# EAGLE design led-er-v3-module-d (EAGLE 7.5.0)
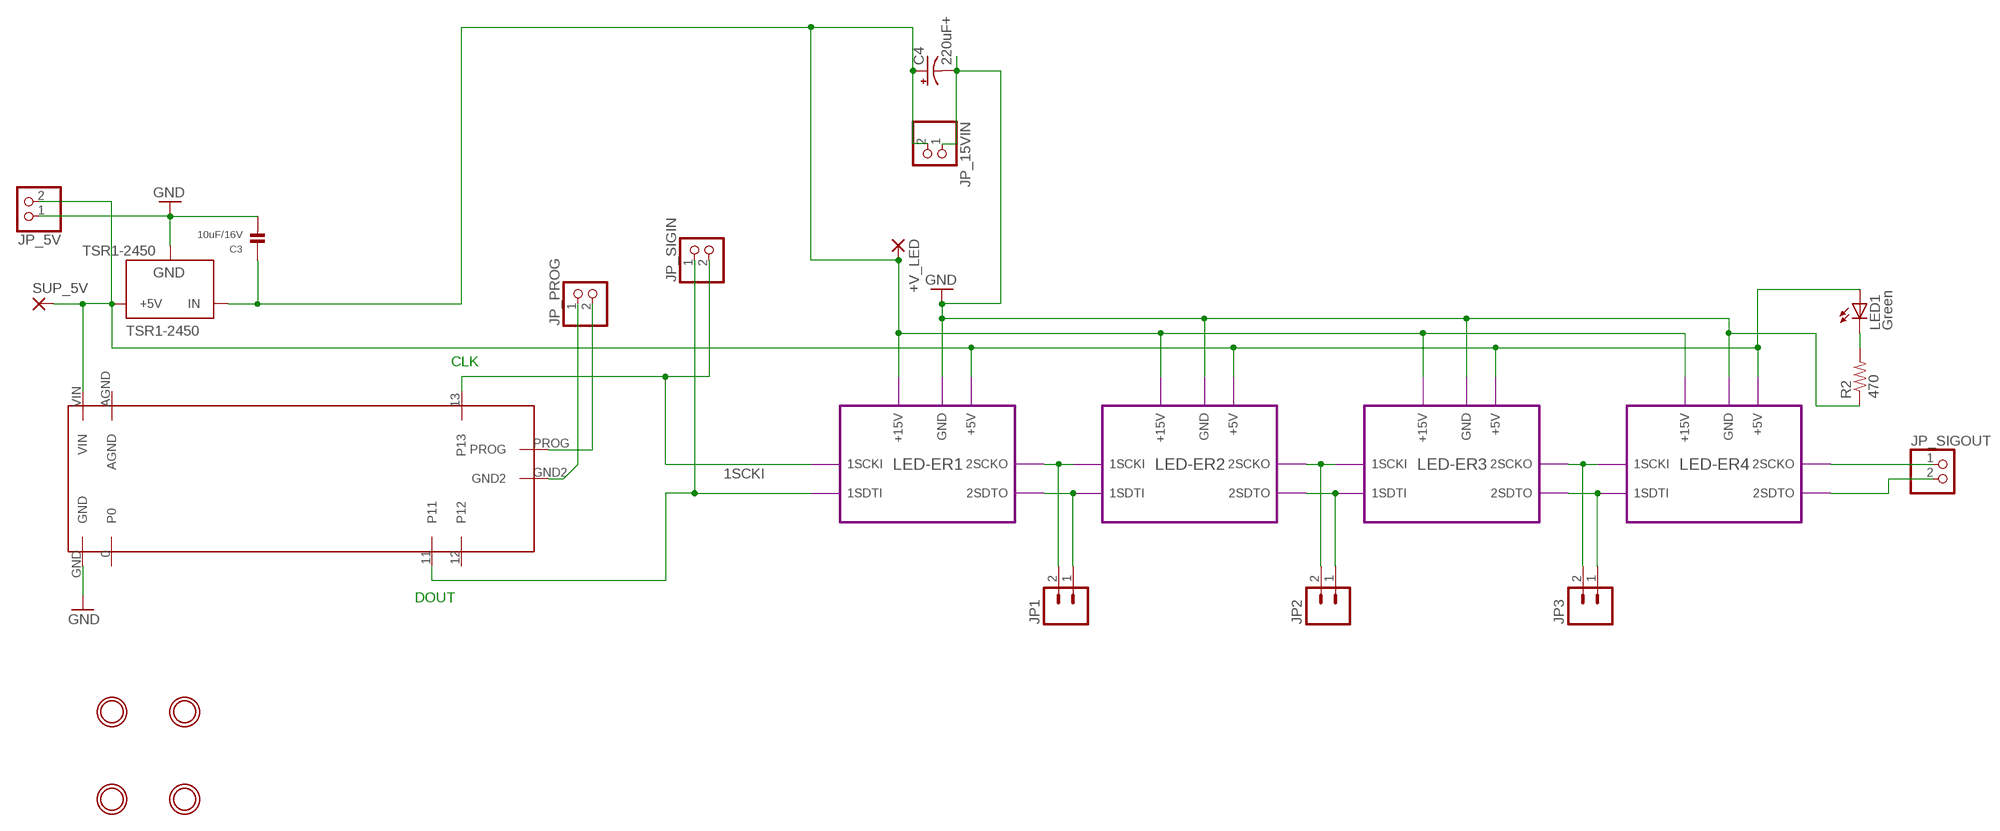
[diagram p0: schematic, sheet 1]

## Parts
+V_LED  3,17/1,1  [3,17/1,1]
C3  10uF/16V  CAP_CERAMIC0805  [0805]
C4  220uF+  CPOL-USE5-8.5  [E5-8,5]
JP1  HEADER_SMD_2_MALESMD-STRAIGHT-ALT-FEMALE  [1X06_SMD_STRAIGHT_ALT]
JP2  HEADER_SMD_2_MALESMD-STRAIGHT-ALT-FEMALE  [1X06_SMD_STRAIGHT_ALT]
JP3  HEADER_SMD_2_MALESMD-STRAIGHT-ALT-FEMALE  [1X06_SMD_STRAIGHT_ALT]
JP_5V  HEADER-1X2  [1X02_OVAL]
JP_15VIN  HEADER-1X2  [1X02_OVAL]
JP_PROG  HEADER-1X2  [1X02_OVAL]
JP_SIGIN  HEADER-1X2  [1X02_OVAL]
JP_SIGOUT  HEADER-1X2  [1X02_OVAL]
LED1  Green  LED5MM  [LED5MM]
R2  470  RESISTOR_DUAL  [0805-THM]
SUP_5V  3,17/1,1  [3,17/1,1]
TSR1-2450  TSR1-2450  [TSR-1]
U$1  MOUNTINGHOLE  [MOUNTINGHOLE_3.0_PLATED]
U$2  MOUNTINGHOLE  [MOUNTINGHOLE_3.0_PLATED]
U$3  MOUNTINGHOLE  [MOUNTINGHOLE_3.0_PLATED]
U$4  MOUNTINGHOLE  [MOUNTINGHOLE_3.0_PLATED]
U$5  TEENSY_LEDER  [TEENSY_LEDER]

## Module instances
LED-ER1 = LED-ER
LED-ER2 = LED-ER
LED-ER3 = LED-ER
LED-ER4 = LED-ER

## Nets
1SCKI: JP_SIGIN.2 U$5.13 ; port LED-ER1.1SCKI
1SDTI: JP_SIGIN.1 U$5.11 ; port LED-ER1.1SDTI
+5V: JP_5V.2 LED1.A SUP_5V.1(P) TSR1-2450.3(+5V) U$5.VIN ; port LED-ER1.+5V LED-ER2.+5V LED-ER3.+5V LED-ER4.+5V
GND: C3.2 C4.- JP_5V.1 JP_15VIN.1 R2.1 TSR1-2450.2(GND) U$5.GND ; port LED-ER1.GND LED-ER2.GND LED-ER3.GND LED-ER4.GND
N$1: LED1.K(C) R2.2
N$2: JP1.2 ; port LED-ER1.2SCKO LED-ER2.1SCKI
N$3: JP1.1 ; port LED-ER1.2SDTO LED-ER2.1SDTI
N$4: JP2.2 ; port LED-ER2.2SCKO LED-ER3.1SCKI
N$5: JP2.1 ; port LED-ER2.2SDTO LED-ER3.1SDTI
N$6: JP3.2 ; port LED-ER3.2SCKO LED-ER4.1SCKI
N$7: JP3.1 ; port LED-ER3.2SDTO LED-ER4.1SDTI
N$8: JP_SIGOUT.1 ; port LED-ER4.2SCKO
N$9: JP_SIGOUT.2 ; port LED-ER4.2SDTO
N$54: JP_PROG.1 U$5.GND2
N$55: JP_PROG.2 U$5.PROG
VIN: +V_LED.1(P) C3.1 C4.+ JP_15VIN.2 TSR1-2450.1(IN) ; port LED-ER1.+15V LED-ER2.+15V LED-ER3.+15V LED-ER4.+15V
Unconnected: U$5.0 U$5.12 U$5.AGND

## Notes on the sheet
- CLK
- DOUT

## Library data of the parts
+V_LED SUP_5V = wirepad:3,17/1,1: THROUGH-HOLE PAD
C3 = microbuilder:CAP_CERAMIC: Ceramic Capacitors 0402 - 0402 Surface Mount Capacitors 16pF 50V 5% [Digikey: 445-4899-2-ND] 18pF 50V 5% [Digikey: 490-1281-2-ND] 22pF 50V 5% [Digikey: 490-1283-2-ND] 68pF 50V 5% [Digikey: 490-1289-2-ND] 0.1uF 10V 10% [Digikey: 490-1318-2-ND] 1.0uF 6.3V 10% [Digikey: 490-1320-2-ND] 0603 - 0603 Surface Mount Capacitors 16 pF 50V 5% [Digikey: 445-5051-2-ND] 22 pF 50V [Digikey: PCC220ACVTR-ND] 33 pF 50V 5% [Digikey: 490-1415-1-ND] 56pF 50V 5% [Digikey: 490-1421-1-ND] 220pF 50V 5% [Digikey: 445-1285-1-ND] 680 pF 50V 2200 pF 50V 5% C0G [Digikey: 445-1297-1-ND] 5600 pF 100V 5% X7R [Digikey: 478-3711-1-ND] 0.1 µF 25V 10% [Digikey: PCC2277TR-ND] 0.22 µF 16V 10% X7R [Digikey: 445-1318-1-ND] 1.0 µF 25V 10% [Digikey: 445-5146-2-ND] 0603 - RF Specific 3pF 250V +/-0.1pF RF [Digikey: 712-1347-1-ND] 18 pF 250V 5% [Digikey: 478-3505-1-ND or 712-1322-1-ND] 56 pF 250V 5% C0G RF [Digikey: 490-4867-1-ND] 68 pF 250V RF [Digikey: 490-4868-1-ND] 0805 - 0805 Surface Mount Capacitors 220 pF 250V 2% RF Ceramic Capacitor [Digikey: 712-1398-1-ND] 1000 pF 50V 2% NP0 Ceramic Capacitor [Digikey: 478-3760-1-ND] 0.1 µF 25V 10% Ceramic Capacitor [Digikey: PCC1828TR-ND] 1.0 µF 16V 10% Ceramic Capacitor[Digikey: 490-1691-2-ND] 10.0 µF 10V 10% Ceramic Capacitor[Digikey: 709-1228-1-ND] 10.0 uF 16V 10% Ceramic Capacitor [Digikey: 478-5165-2-ND] 47 uF 6.3V 20% Ceramic Capacitor [Digikey: 587-1779-1-ND or 399-5506-1-ND] 1206 - 1206 Surface Mount Capacitors 47uF 10V 20% Ceramic Capacitor [Digikey: 490-5528-1-ND or 399-5508-1-ND or 445-6010-1-ND] 100uF 6.3V -20%, +80% Y5V Ceramic Capacitor (Digikey: 490-4512-1-ND, Mouser: 81-GRM31CF50J107ZE1L)
C4 = adafruit:CPOL-US: POLARIZED CAPACITOR, American symbol
JP1-JP3 = Andrews:HEADER_SMD_2_MALE: Header 6 Standard 6-pin 0.1" header. Use with straight break away headers (SKU : PRT-00116), right angle break away headers (PRT-00553), swiss pins (PRT-00743), machine pins (PRT-00117), and female headers (PRT-00115). Molex polarized connector foot print use with SKU : PRT-08094 with associated crimp pins and housings. NOTES ON THE VARIANTS LOCK and LOCK_LONGPADS... This footprint was designed to help hold the alignment of a through-hole component (i.e. 6-pin header) while soldering it into place. You may notice that each hole has been shifted either up or down by 0.005 of an inch from it's more standard position (which is a perfectly straight line). This slight alteration caused the pins (the squares in the middle) to touch the edges of the holes. Because they are alternating, it causes a "brace" to hold the component in place. 0.005 has proven to be the perfect amount of "off-center" position when using our standard breakaway headers. Although looks a little odd when you look at the bare footprint, once you have a header in there, the alteration is very hard to notice. Also,if you push a header all the way into place, it is covered up entirely on the bottom side. This idea of altering the position of holes to aid alignment will be further integrated into the Sparkfun Library for other footprints. It can help hold any component with 3 or more connection pins.; PROD_ID: CONN-10203
JP_5V JP_15VIN JP_PROG JP_SIGIN JP_SIGOUT = microbuilder:HEADER-1X2: PIN HEADER
LED1 = adafruit:LED: LED OSRAM: - CHIPLED LG R971, LG N971, LY N971, LG Q971, LY Q971, LO R971, LY R971 LH N974, LH R974 LS Q976, LO Q976, LY Q976 LO Q996 - Hyper CHIPLED LW Q18S LB Q993, LB Q99A, LB R99A - SideLED LS A670, LO A670, LY A670, LG A670, LP A670 LB A673, LV A673, LT A673, LW A673 LH A674 LY A675 LS A676, LA A676, LO A676, LY A676, LW A676 LS A679, LY A679, LG A679 - Hyper Micro SIDELED® LS Y876, LA Y876, LO Y876, LY Y876 LT Y87S - SmartLED LW L88C, LW L88S LB L89C, LB L89S, LG L890 LS L89K, LO L89K, LY L89K LS L896, LA L896, LO L896, LY L896 - TOPLED LS T670, LO T670, LY T670, LG T670, LP T670 LSG T670, LSP T670, LSY T670, LOP T670, LYG T670 LG T671, LOG T671, LSG T671 LB T673, LV T673, LT T673, LW T673 LH T674 LS T676, LA T676, LO T676, LY T676, LB T676, LH T676, LSB T676, LW T676 LB T67C, LV T67C, LT T67C, LS T67K, LO T67K, LY T67K, LW E67C LS E67B, LA E67B, LO E67B, LY E67B, LB E67C, LV E67C, LT E67C LW T67C LS T679, LY T679, LG T679 LS T770, LO T770, LY T770, LG T770, LP T770 LB T773, LV T773, LT T773, LW T773 LH T774 LS E675, LA E675, LY E675, LS T675 LS T776, LA T776, LO T776, LY T776, LB T776 LHGB T686 LT T68C, LB T68C - Hyper Mini TOPLED® LB M676 - Mini TOPLED Santana® LG M470 LS M47K, LO M47K, LY M47K Source: http://www.osram.convergy.de/
R2 = microbuilder:RESISTOR_DUAL: Flip Flop resistor An 0805 resistor inside a standard 1/4W 5% resistor. Makes for easy mods Footprint taken from the Adafruit Industries Eagle Library.
TSR1-2450 = SteelCaveRobotics-Power:TSR1-2450: Traco Power TSR 1-2450 5.0v switching regulator
U$1-U$4 = microbuilder:MOUNTINGHOLE: Mounting Hole For #2 screws (0.086"/2.18mm width, 0.094"/2.4mm hole) use 2.5mm
U$5 = Andrews:TEENSY_LEDER

## Module LED-ER
Ports: 1SCKI(io) 1SDTI(io) 2SCKO(io) 2SDTO(io) +15V(io) GND(io) +5V(io)
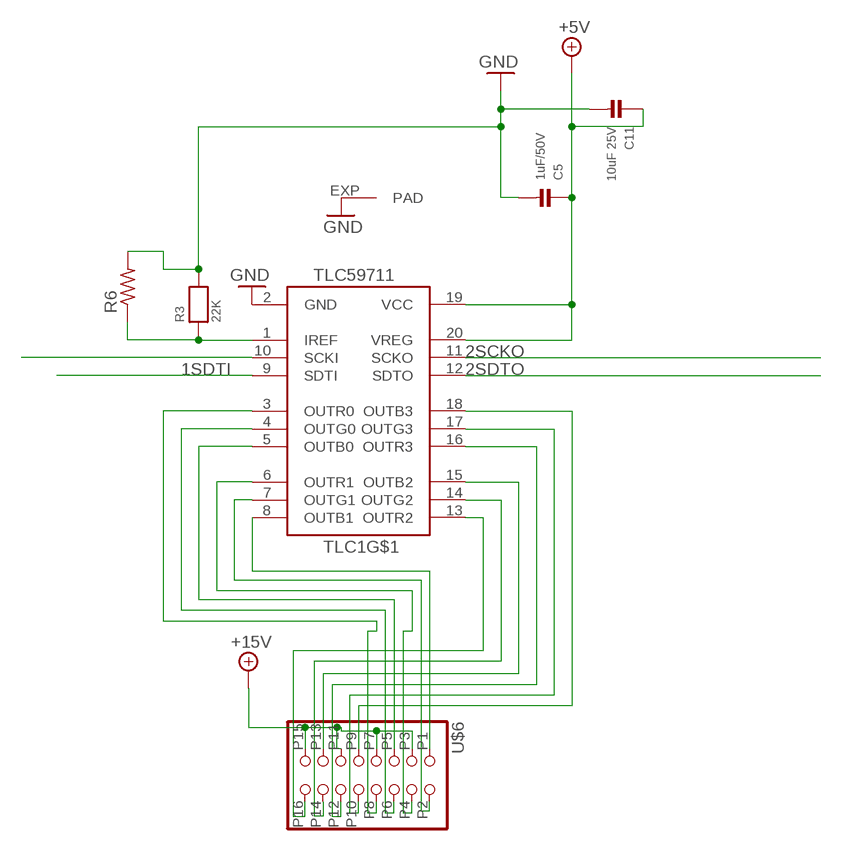
[diagram p1: schematic, module LED-ER, sheet 1]

### Parts
C5  1uF/50V  CAP_CERAMIC0805  [0805]
C11  10uF 25V  CAP_CERAMIC0805  [0805]
R3  22K  RESISTOR0805  [0805]
R6  R-US_0207/9  [0207/9]
TLC1  TLC59711  [HTSSOP20DAP]
U$6  HEADER-2X8-RIBBON  [2X08_RIBBON]

### Nets
1SCKI: TLC1.10(SCKI)
1SDTI: TLC1.9(SDTI)
2SCKO: TLC1.11(SCKO)
2SDTO: TLC1.12(SDTO)
+5V: C5.1 C11.1 TLC1.19(VCC) TLC1.20(VREG)
+15V: U$6.P3(P4) U$6.P7(P8) U$6.P11(P12) U$6.P15(P16)
B0: TLC1.5(OUTB0) U$6.P5(P6)
B1: TLC1.8(OUTB1) U$6.P1
B2: TLC1.15(OUTB2) U$6.P13(P14)
B3: TLC1.18(OUTB3) U$6.P9(P10)
G0: TLC1.4(OUTG0) U$6.P6(P5)
G1: TLC1.7(OUTG1) U$6.P2
G2: TLC1.14(OUTG2) U$6.P14(P13)
G3: TLC1.17(OUTG3) U$6.P10(P9)
GND: C5.2 C11.2 R3.2 R6.2 TLC1.2(GND) TLC1.EXP(PAD)
IREF: R3.1 R6.1 TLC1.1(IREF)
R0: TLC1.3(OUTR0) U$6.P8(P7)
R1: TLC1.6(OUTR1) U$6.P4(P3)
R2: TLC1.13(OUTR2) U$6.P16(P15)
R3: TLC1.16(OUTR3) U$6.P12(P11)

### Library data of the parts
C5 C11 = microbuilder:CAP_CERAMIC: Ceramic Capacitors 0402 - 0402 Surface Mount Capacitors 16pF 50V 5% [Digikey: 445-4899-2-ND] 18pF 50V 5% [Digikey: 490-1281-2-ND] 22pF 50V 5% [Digikey: 490-1283-2-ND] 68pF 50V 5% [Digikey: 490-1289-2-ND] 0.1uF 10V 10% [Digikey: 490-1318-2-ND] 1.0uF 6.3V 10% [Digikey: 490-1320-2-ND] 0603 - 0603 Surface Mount Capacitors 16 pF 50V 5% [Digikey: 445-5051-2-ND] 22 pF 50V [Digikey: PCC220ACVTR-ND] 33 pF 50V 5% [Digikey: 490-1415-1-ND] 56pF 50V 5% [Digikey: 490-1421-1-ND] 220pF 50V 5% [Digikey: 445-1285-1-ND] 680 pF 50V 2200 pF 50V 5% C0G [Digikey: 445-1297-1-ND] 5600 pF 100V 5% X7R [Digikey: 478-3711-1-ND] 0.1 µF 25V 10% [Digikey: PCC2277TR-ND] 0.22 µF 16V 10% X7R [Digikey: 445-1318-1-ND] 1.0 µF 25V 10% [Digikey: 445-5146-2-ND] 0603 - RF Specific 3pF 250V +/-0.1pF RF [Digikey: 712-1347-1-ND] 18 pF 250V 5% [Digikey: 478-3505-1-ND or 712-1322-1-ND] 56 pF 250V 5% C0G RF [Digikey: 490-4867-1-ND] 68 pF 250V RF [Digikey: 490-4868-1-ND] 0805 - 0805 Surface Mount Capacitors 220 pF 250V 2% RF Ceramic Capacitor [Digikey: 712-1398-1-ND] 1000 pF 50V 2% NP0 Ceramic Capacitor [Digikey: 478-3760-1-ND] 0.1 µF 25V 10% Ceramic Capacitor [Digikey: PCC1828TR-ND] 1.0 µF 16V 10% Ceramic Capacitor[Digikey: 490-1691-2-ND] 10.0 µF 10V 10% Ceramic Capacitor[Digikey: 709-1228-1-ND] 10.0 uF 16V 10% Ceramic Capacitor [Digikey: 478-5165-2-ND] 47 uF 6.3V 20% Ceramic Capacitor [Digikey: 587-1779-1-ND or 399-5506-1-ND] 1206 - 1206 Surface Mount Capacitors 47uF 10V 20% Ceramic Capacitor [Digikey: 490-5528-1-ND or 399-5508-1-ND or 445-6010-1-ND] 100uF 6.3V -20%, +80% Y5V Ceramic Capacitor (Digikey: 490-4512-1-ND, Mouser: 81-GRM31CF50J107ZE1L)
R3 = microbuilder:RESISTOR: Resistors 0402 - 0402 Surface Mount Package 22 Ohm 1% 1/16W [Digikey: 311-22.0LRTR-ND] 33 Ohm 5% 1/16W 1.0K 5% 1/16W 1.5K 5% 1/16W 2.0K 1% 1/16W 10.0K 1% 1/16W [Digikey: 311-10.0KLRTR-ND] 10.0K 5% 1/16W [Digikey: RMCF0402JT10K0TR-ND] 12.1K 1% 1/16W [Digikey: 311-22.0LRTR-ND] 100.0K 5% 1/16W 0603 - 0603 Surface Mount Package 0 Ohm 1/10 Watt 1% Resistor 15 Ohm 1/10 Watt 1% Resistor 33 Ohm 1/10 Watt 1% Resistor 49.9 Ohm 1/10 Watt 1% Resistor 100 Ohm 1/10 Watt 1% Resistor 150 Ohm 1/10 Watt 1% Resistor 240 Ohm 1/10 Watt 1% Resistor 390 Ohm 1/10 Watt 1% Resistor 560 Ohm 1/10 Watt 1% Resistor 680 Ohm 1/10 Watt 1% Resistor 750 Ohm 1/10 Watt 1% Resistor 1.0K Ohm 1/10 Watt 1% Resistor 1.5K Ohm 1/10 Watt 1% Resistor 2.0K Ohm 1/10 Watt 1% Resistor 2.2K Ohm 1/10 Watt 1% Resistor 3.3K Ohm 1/10 Watt 1% Resistor 4.7K Ohm 1/10 Watt 1% Resistor 10.0K Ohm 1/10 Watt 1% Resistor 12.0K Ohm 1/10 Watt 1% Resistor 12.1K Ohm 1/10 Watt 1% Resistor 20.0K Ohm 1/10 Watt 1% Resistor 33.0K Ohm 1/10 Watt 1% Resistor 100.0K Ohm 1/10 Watt 1% Resistor 0805 - 0805 Surface Mount Package 0 Ohm 1/8 Watt 1% Resistor 33 Ohm 1/8 Watt 1% Resistor 100 Ohm 1/8 Watt 1% Resistor 150 Ohm 1/8 Watt 1% Resistor 200 Ohm 1/8 Watt 1% Resistor 240 Ohm 1/8 Watt 1% Resistor 330 Ohm 1/8 Watt 1% Resistor 390 Ohm 1/8 Watt 1% Resistor 470 Ohm 1/8 Watt 1% Resistor 1.0K Ohm 1/8 Watt 1% Resistor 1.5K Ohm 1/8 Watt 1% Resistor 2.0K Ohm 1/8 Watt 1% Resistor 4.7K Ohm 1/8 Watt 1% Resistor 5.1K Ohm 1/8 Watt 1% Resistor 5.6K Ohm 1/8 Watt 1% Resistor 10.0K Ohm 1/8 Watt 1% Resistor 22.0K Ohm 1/8 Watt 1% Resistor 33.0K Ohm 1/8 Watt 1% Resistor 100K Ohm 1/8 Watt 1% Resistor 1206 - 1206 Surface Mount Package 2012 - 2010 Surface Mount Package 0.11 Ohm 1/2 Watt 1% Resistor - Digikey: RHM.11UCT-ND
R6 = adafruit:R-US_: RESISTOR, American symbol
TLC1 = adafruit:TLC59711
U$6 = Andrews:HEADER-2X8-RIBBON

## Board
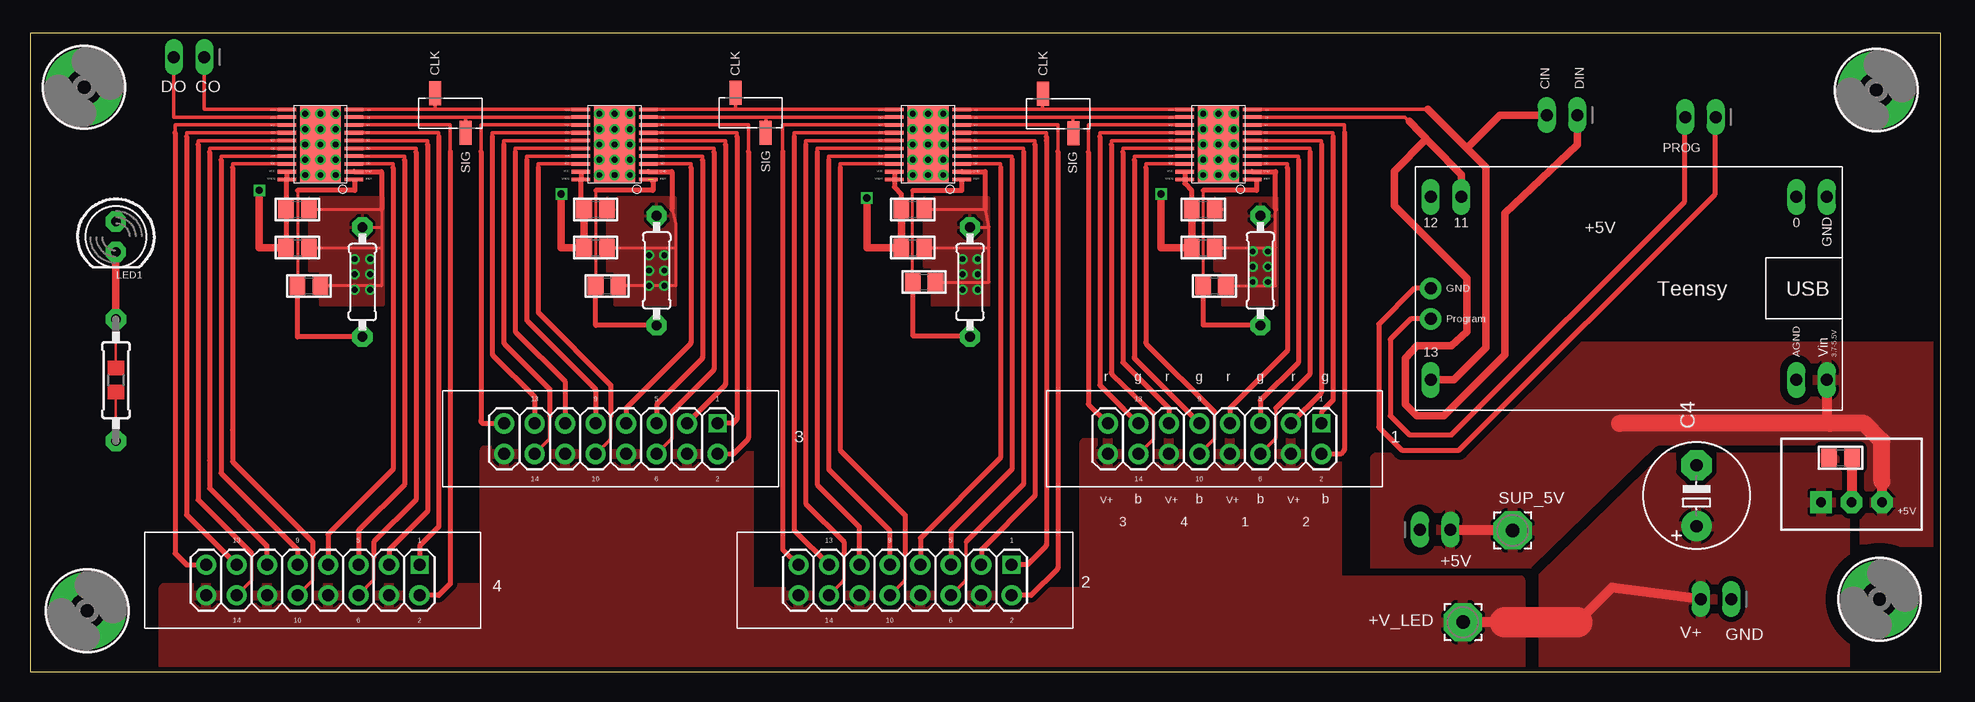
[diagram p2: board, top side]
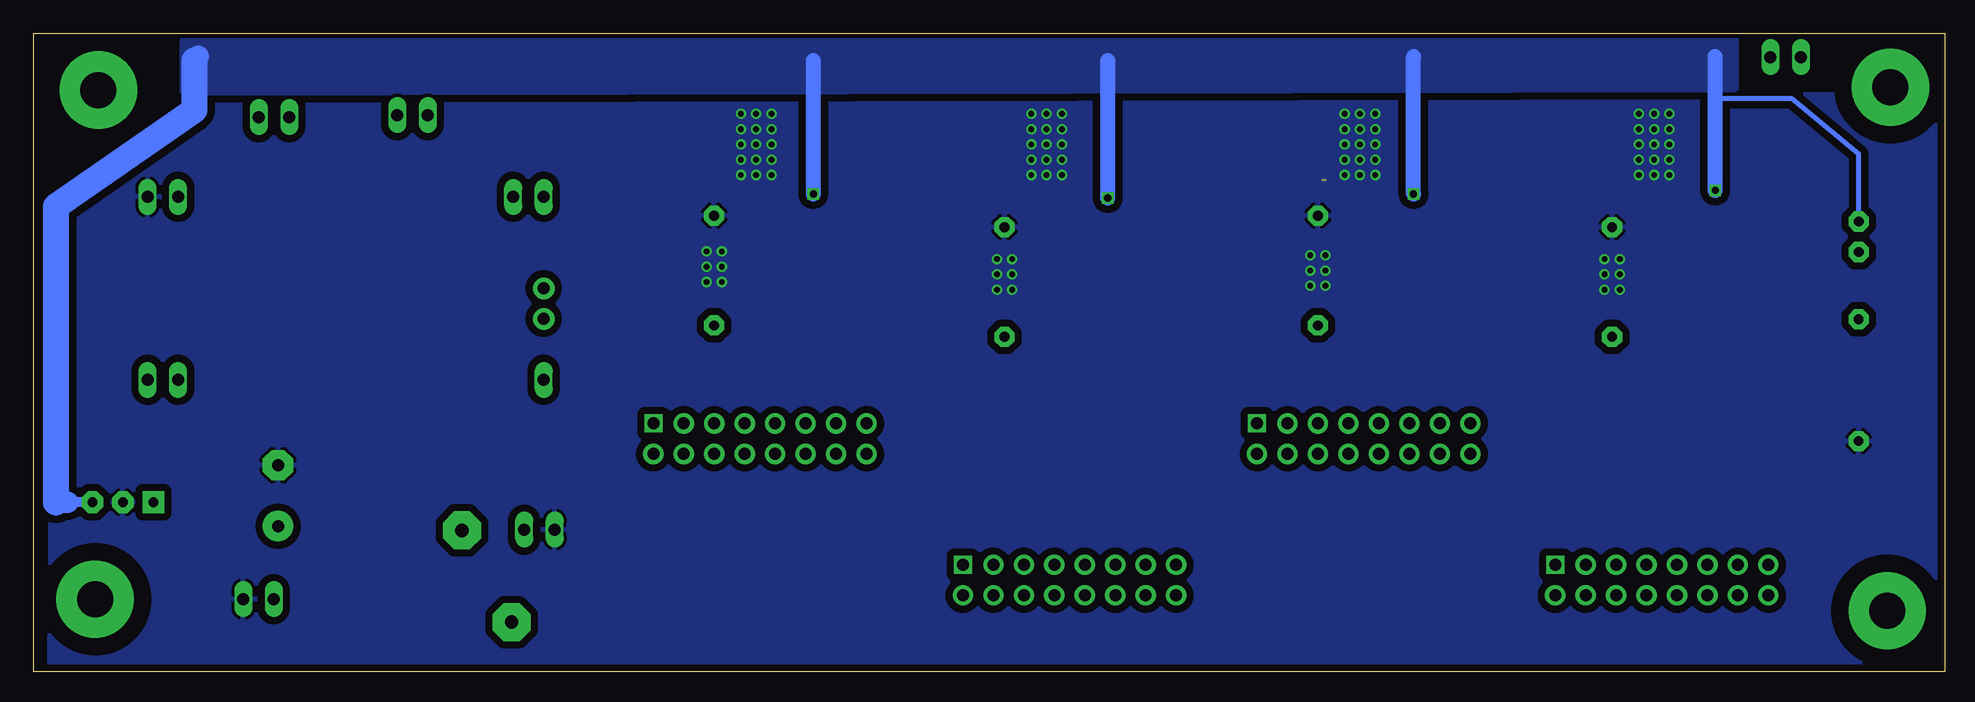
[diagram p3: board, bottom side, seen from below]

Size 159.28 x 53.23 mm. Coordinates in mm from the lower left corner, seen from the top.
Outline: 159.28,0 159.28,53.23 0,53.23 0,0 159.26,0
Copper layers (1*16): Top 0.0356mm / dielectric 1.5011mm / Bottom 0.0356mm
Design rules "LaenPCBOrder": minimum track width 6mil, minimum drill 13mil, track to track 6mil, track to pad 6mil, pad to pad 6mil, via to via 6mil, smd to smd 6mil, copper to edge 15mil, drill to drill 6mil, minimum pad ring 7mil, minimum via ring 7mil, stop-mask expansion 3mil, vias tented up to drill 0mil, thermal gap 10mil

### Footprints (pad centres in the part's own frame; a part is rotated, then mirrored left to right if it is on the bottom)
3,17/1,1 = drill 1.118 pad 3.175 octagon: 1 0,0
0805 = smd 1.3 x 1.5: 1 -0.95,0; 2 0.95,0
E5-8,5 = drill 1.016 pad 2.54: + -2.54,0 | drill 1.016 pad 2.54 octagon: - 2.54,0
1X06_SMD_STRAIGHT_ALT = smd 1 x 2: 1 0,-1.65; 2 -2.54,1.65
1X02_OVAL = drill 1 long: 1 -1.27,0; 2 1.27,0
LED5MM = drill 0.813 pad 1.676 octagon: A -1.27,0; K 1.27,0
0207/9 = drill 0.813 pad 1.676 octagon: 1 -4.572,0; 2 4.572,0
HTSSOP20DAP = smd 0.3 x 1.55: 1 -2.925,-2.8; 2 -2.275,-2.8; 3 -1.625,-2.8; 4 -0.975,-2.8; 5 -0.325,-2.8; 6 0.325,-2.8; 7 0.975,-2.8; 8 1.625,-2.8; 9 2.275,-2.8; 10 2.925,-2.8; 11 2.925,2.8; 12 2.275,2.8; 13 1.625,2.8; 14 0.975,2.8; 15 0.325,2.8; 16 -0.325,2.8; 17 -0.975,2.8; 18 -1.625,2.8; 19 -2.275,2.8; 20 -2.925,2.8 | smd 6.5 x 3.4: EXP 0,0
2X08_RIBBON = drill 1 pad 1.676: P1 -8.89,1.27; P3 -6.35,1.27; P4 -6.35,-1.27; P5 -3.81,1.27; P6 -3.81,-1.27; P7 -1.27,1.27; P8 -1.27,-1.27; P9 1.27,1.27; P10 1.27,-1.27; P11 3.81,1.27; P12 3.81,-1.27; P13 6.35,1.27; P14 6.35,-1.27; P15 8.89,1.27; P16 8.89,-1.27 | drill 1 square: P2 -8.89,-1.27
0805-THM = drill 0.813 pad 1.676 octagon: 1 -5.08,0; 2 5.08,0
TSR-1 = drill 0.8 pad 1.8 square: 1 -2.54,-1.5 | drill 0.8 pad 1.8 octagon: 2 0,-1.5; 3 2.54,-1.5
MOUNTINGHOLE_3.0_PLATED = drill 3 pad 6.452: P$1 0,0
TEENSY_LEDER = drill 1 pad 1.422 long: 0 12.7,7.62; 11 -15.24,7.62; 12 -17.78,7.62; 13 -17.78,-7.62; AGND 12.7,-7.62; GND 15.24,7.62; VIN 15.24,-7.62 | drill 1 pad 1.778: GND2 -17.78,0; PROG -17.78,-2.54

### Placement (x,y rotation side)
+V_LED  119.44,4.14 0 top
C3  150.92,17.84 0 top
C4  138.91,14.68 90 top
JP1  86.97,46.52 0 top
JP2  61.33,46.6 0 top
JP3  36.32,46.56 0 top
JP_5V  117.13,11.85 0 top
JP_15VIN  140.53,6.06 180 top
JP_PROG  139.24,46.23 180 top
JP_SIGIN  127.7,46.4 180 top
JP_SIGOUT  13.25,51.24 180 top
LED1  7.16,36.26 270 top
LED-ER1:C5  1uF/50V  [0805]  97.78,38.54 0 top
LED-ER1:C11  10uF 25V  [0805]  97.78,35.36 0 top
LED-ER1:R3  22K  [0805]  98.74,32.17 0 top
LED-ER1:R6  [0207/9]  102.56,33.44 90 top
LED-ER1:TLC1  TLC59711  [HTSSOP20DAP]  99.06,43.96 90 top
LED-ER1:U$6  HEADER-2X8-RIBBON  [2X08_RIBBON]  98.74,19.43 180 top
LED-ER2:C5  1uF/50V  [0805]  73.58,38.54 0 top
LED-ER2:C11  10uF 25V  [0805]  73.58,35.36 0 top
LED-ER2:R3  22K  [0805]  74.53,32.49 0 top
LED-ER2:R6  [0207/9]  78.35,32.49 90 top
LED-ER2:TLC1  TLC59711  [HTSSOP20DAP]  74.85,43.96 90 top
LED-ER2:U$6  HEADER-2X8-RIBBON  [2X08_RIBBON]  72.94,7.64 180 top
LED-ER3:C5  1uF/50V  [0805]  47.14,35.36 0 top
LED-ER3:C11  10uF 25V  [0805]  47.14,38.54 0 top
LED-ER3:R3  22K  [0805]  48.1,32.17 0 top
LED-ER3:R6  [0207/9]  52.24,33.44 90 top
LED-ER3:TLC1  TLC59711  [HTSSOP20DAP]  48.73,43.96 90 top
LED-ER3:U$6  HEADER-2X8-RIBBON  [2X08_RIBBON]  48.41,19.43 180 top
LED-ER4:C5  1uF/50V  [0805]  22.3,35.36 0 top
LED-ER4:C11  10uF 25V  [0805]  22.3,38.54 0 top
LED-ER4:R3  22K  [0805]  23.25,32.17 0 top
LED-ER4:R6  [0207/9]  27.71,32.49 90 top
LED-ER4:TLC1  TLC59711  [HTSSOP20DAP]  24.21,43.96 90 top
LED-ER4:U$6  HEADER-2X8-RIBBON  [2X08_RIBBON]  23.57,7.64 180 top
R2  7.16,24.31 90 top
SUP_5V  123.58,11.79 0 top
TSR1-2450  151.84,15.63 0 top
U$1  153.89,48.48 0 top
U$2  4.78,5.1 0 top
U$3  4.51,48.72 0 top
U$4  154.16,6.05 0 top
U$5  134.54,31.95 0 top

### Tracks (layer width: path | path; a pad name or v marks a point on that pad's centre or on a via)
1SCKI
  Top 0.305: LED-ER1:TLC1.10 116.52,46.88 | U$5.13
  Top 0.61: 116.52,46.88 119.76,43.64 | 119.76,43.64 121.36,42.04 121.36,27.01 118.68,24.33 U$5.13 | JP_SIGIN.2 122.53,46.4 119.76,43.64
1SDTI
  Top 0.305: LED-ER1:TLC1.9 114.62,46.23 114.98,45.87 | 119.31,39.58 U$5.11
  Top 0.61: 116.85,43.91 116.37,44.38 113.71,41.73 113.71,38.86 119.76,32.81 119.76,28.35 118.49,27.17 115.62,27.17 114.67,26.12 114.67,22.3 115.62,21.34 117.85,21.34 122.95,26.44 122.95,38.22 128.97,43.93 JP_SIGIN.1 | 116.85,43.91 119.31,41.45 119.31,39.58 | 114.98,45.87 116.85,43.91
+5V  (via drill 0.6)
  Top 0.254: LED-ER1:TLC1.20 | LED-ER3:TLC1.20 46.19,41.03 | LED-ER4:TLC1.20 21.35,41.03 | LED-ER2:C5.1 | LED-ER3:C11.1
  Top 0.305: LED-ER1:C5.1 | LED-ER2:C5.1 | LED-ER4:TLC1.19 21.41,41.55 | LED-ER3:TLC1.19 45.93,41.57 | LED-ER2:TLC1.19 | LED-ER2:TLC1.19 72.05,41.58 | LED-ER1:TLC1.19 | LED-ER1:TLC1.19 96.26,41.59
  Top 0.406: LED-ER4:C5.1 LED-ER4:C11.1 21.41,38.54 LED-ER4:TLC1.20 21.41,41.55 | LED-ER1:C5.1 96.83,40.13 96.26,40.7 LED-ER1:TLC1.20 96.26,41.59 | LED-ER2:C5.1 72.62,39.81 72.05,40.38 LED-ER2:TLC1.20 72.05,41.58 | LED-ER3:C11.1 45.93,38.54 LED-ER3:TLC1.20 45.93,41.57 | 72.05,41.58 | 96.26,41.59 | LED-ER1:C11.1 | LED-ER2:C11.1
  Top 0.61: v94.28,39.81 94.28,35.35 LED-ER1:C11.1 LED-ER1:C5.1 | v69.75,39.5 69.75,35.35 LED-ER2:C11.1 LED-ER2:C5.1 | LED-ER3:C11.1 LED-ER3:C5.1 44.27,35.35 v44.27,39.81 | LED-ER4:C5.1 19.11,35.35 v19.11,40.13
  Top 0.813: TSR1-2450.3 154.38,15.85 154.36,15.88 | U$5.VIN 149.78,20.95 150.02,20.7 | SUP_5V.1 118.46,11.79 JP_5V.2
  Top 1.422: 154.36,15.88 154.36,19.23 152.89,20.7 150.02,20.7 132.5,20.7
  Bottom 0.406: LED1.A 7.16,43.15 12.74,47.78 19.11,47.78
  Bottom 0.813: TSR1-2450.3 156.05,14.13 156.46,14.14
  Bottom 1.27: v94.28,39.81 94.28,50.96 | v69.75,39.5 69.75,50.96 | v44.27,39.81 44.27,51.28 | v19.11,40.13 19.11,47.78 19.11,51.28
  Bottom 1.778: 156.46,14.14 157.41,14.11 | 145.88,50.96 145.56,51.28
  Bottom 2.184: 157.41,14.11 157.41,38.8 145.88,46.82 145.88,50.96
  pour Bottom (isolate 0.305): 17.52,48.73 17.52,52.87 146.72,52.56 146.72,48.41
  pour Top (isolate 0.61, rank 3): 112.12,17.84 112.12,8.6 124.86,8.6 136.01,19.11 152.89,19.11 152.89,10.83 158.94,10.83 158.94,27.07 129,27.07 119.76,17.84
GND  (via drill 0.48)  (3 unrouted)
  Top 0.254: LED-ER1:TLC1.2 | LED-ER1:R3.2 103.83,32.17 103.83,35.35 | 103.83,35.35 103.83,38.54 | LED-ER2:C5.2 | LED-ER2:R3.2 79.95,32.49 79.95,35.35 | 79.95,35.35 79.95,37.06 | 79.95,37.06 79.63,38.54 LED-ER2:C5.2 | LED-ER2:R6.2 79.95,37.06 | 53.51,38.54 53.83,37.38 53.83,35.35 | 53.83,35.35 53.83,32.17 v52.87,32.17 v51.6,32.17 LED-ER3:R3.2 | LED-ER3:R3.2 | 29.3,37.06 29.3,38.54 LED-ER4:C11.2 | 29.3,37.06 29.3,35.35 | 29.3,35.35 29.3,32.17 LED-ER4:R3.2 | LED-ER4:R6.2 29.3,37.06 | LED-ER4:C5.2 29.3,35.35 | LED-ER3:C5.2 53.83,35.35 | LED-ER2:C11.2 79.95,35.35 | LED-ER1:C11.2 103.83,35.35
  Top 0.305: 29.3,41.68 29.3,41.63 | 53.51,41.68 53.51,41.62 | 103.83,41.68 103.83,41.62
  Top 0.406: 103.83,38.54 103.83,41.62 | 79.63,38.54 79.63,41.68 LED-ER2:TLC1.2 | 53.51,41.62 53.51,38.54 | 29.3,41.63 29.3,38.54 | LED-ER4:TLC1.2 29.3,41.68 | LED-ER3:TLC1.2 53.51,41.68 | LED-ER1:TLC1.2 103.83,41.68
  Top 0.813: C3.2 151.87,14.13 TSR1-2450.2
  other vias: 22.93,46.5 24.21,46.5 25.48,46.5 22.93,45.23 24.21,45.23 22.93,43.96 24.21,43.96 25.48,43.96 22.93,42.68 24.21,42.68 25.48,42.68 22.93,41.41 24.21,41.41 25.48,41.41 25.48,45.23 97.78,46.5 99.06,46.5 100.33,46.5 97.78,45.23 99.06,45.23 100.33,45.23 97.78,43.96 99.06,43.96 100.33,43.96 97.78,42.68 99.06,42.68 100.33,42.68 97.78,41.41 99.06,41.41 100.33,41.41 73.58,46.5 74.85,46.5 76.13,46.5 73.58,45.23 74.85,45.23 76.13,45.23 73.58,43.96 74.85,43.96 76.13,43.96 73.58,42.68 74.85,42.68 76.13,42.68 73.58,41.41 74.85,41.41 76.13,41.41 47.46,46.5 48.73,46.5 50.01,46.5 47.46,45.23 48.73,45.23 47.46,43.96 48.73,43.96 50.01,43.96 47.46,42.68 48.73,42.68 50.01,42.68 47.46,41.41 48.73,41.41 50.01,41.41 50.01,45.23 27.07,34.4 27.07,33.13 28.35,33.13 27.07,31.85 28.35,31.85 28.35,34.4 51.6,34.72 52.87,34.72 51.6,33.44 52.87,33.44 77.72,34.4 77.72,33.13 77.72,31.85 78.99,31.85 78.99,33.13 78.99,34.4 101.93,35.04 103.2,35.04 101.93,33.76 103.2,33.76 101.93,32.49 103.2,32.49
  pour Top: 98.74,39.5 98.74,33.44 99.38,33.44 99.38,30.58 104,30.56 104,39.48
  pour Top: 74.53,39.5 74.53,33.76 75.17,33.76 75.17,30.58 79.95,30.58 79.95,39.5
  pour Top: 48.1,33.44 48.73,33.44 48.73,30.58 53.83,30.58 53.83,39.5 48.1,39.5
  pour Top: 23.25,39.5 23.25,33.44 24.21,33.44 24.21,30.58 29.46,30.61 29.46,39.53
  pour Bottom (isolate 0.61, rank 2): 0,48.1 157.67,48.1 157.98,0 0,0
LED-ER1:B0
  Top 0.305: LED-ER1:TLC1.5 106.7,43.63 106.7,43.31 | 103.84,21.98 103.84,19.55 arc-45 103.76,19.37 LED-ER1:U$6.P5
  Top 0.406: 106.7,43.31 106.7,24.95 arc-45 106.63,24.77 103.84,21.98
LED-ER1:B1
  Top 0.305: LED-ER1:TLC1.8 109.57,45.58 109.57,44.59
  Top 0.406: 109.57,44.94 109.57,44.59 109.57,18.58 arc-45 109.5,18.4 109.25,18.16 LED-ER1:U$6.P1 arc-45 LED-ER1:U$6.P1
LED-ER1:B2
  Top 0.305: LED-ER1:TLC1.15 90.14,44.28 90.14,43.96 | 93.67,21.51 93.67,19.54 arc-45 93.59,19.36 LED-ER1:U$6.P13
  Top 0.406: 90.14,43.96 90.14,24.95 arc45 90.21,24.77 93.67,21.51
LED-ER1:B3
  Top 0.305: LED-ER1:TLC1.18 93.01,42.33 93.01,42.01 | 98.74,21.66 98.74,19.54 arc-45 98.67,19.36 LED-ER1:U$6.P9
  Top 0.406: 93.01,42.01 93.01,27.5 arc45 93.08,27.32 98.74,21.66
LED-ER1:G0
  Top 0.305: LED-ER1:TLC1.4 105.75,42.98 105.75,42.66
  Top 0.406: 105.75,42.66 105.75,25.91 arc-45 105.67,25.73 102.56,22.61 102.56,20.73 arc-45 LED-ER1:U$6.P6
LED-ER1:G1
  Top 0.305: LED-ER1:TLC1.7 108.61,44.93 108.61,44.61
  Top 0.406: 108.61,44.61 108.61,22.72 arc-45 108.54,22.54 107.66,21.66 107.66,20.77 arc-45 LED-ER1:U$6.P2
LED-ER1:G2
  Top 0.305: LED-ER1:TLC1.14 89.18,44.93 89.18,44.61
  Top 0.406: 89.18,44.61 89.18,23.89 91.1,21.98 arc-45 91.12,21.97 LED-ER1:U$6.P14
LED-ER1:G3
  Top 0.305: LED-ER1:TLC1.17 92.05,42.98 92.05,42.66
  Top 0.406: 92.05,42.66 92.05,26.22 arc45 92.13,26.04 LED-ER1:U$6.P10
LED-ER1:IREF
  Top 0.254: LED-ER1:TLC1.1 102.24,41.03 | 97.79,40.13 LED-ER1:R3.1 | 102.56,28.92 LED-ER1:R6.1
  Top 0.305: 102.24,41.03 102.24,40.91
  Top 0.406: 97.79,40.13 102.24,40.13 102.24,40.91 | LED-ER1:R3.1 97.78,28.92 102.56,28.92
LED-ER1:R0
  Top 0.305: LED-ER1:TLC1.3 104.79,42.33 104.79,42.01
  Top 0.406: 104.79,42.01 104.79,26.75 100.01,21.98 LED-ER1:U$6.P8 arc-45 LED-ER1:U$6.P8
LED-ER1:R1
  Top 0.305: LED-ER1:TLC1.6 107.66,44.28 107.66,43.96
  Top 0.406: 107.66,43.96 107.66,23.37 arc-45 107.58,23.19 LED-ER1:U$6.P4
LED-ER1:R2
  Top 0.305: LED-ER1:TLC1.13 88.23,45.58 88.23,43.32
  Top 0.406: LED-ER1:U$6.P16 88.23,22.32 88.23,43.32 | 88.23,43.32
LED-ER1:R3
  Top 0.305: LED-ER1:TLC1.16 91.1,43.63 91.1,43.31
  Top 0.406: 91.1,43.31 91.1,25.8 94.92,21.98 94.92,20.73 arc45 LED-ER1:U$6.P12
LED-ER2:B0
  Top 0.305: LED-ER2:TLC1.5 82.81,43.63 82.81,43 | 78.04,10.83 78.04,7.77 arc-45 77.96,7.59 LED-ER2:U$6.P5
  Top 0.406: 82.81,43.31 82.81,43 82.81,15.71 arc-45 82.74,15.53 78.04,10.83
LED-ER2:B1
  Top 0.305: LED-ER2:TLC1.8 85.68,45.58 85.68,43.35
  Top 0.406: 85.68,43.35 85.68,8.71 arc-45 85.61,8.53 83.45,6.37 LED-ER2:U$6.P1 arc-45 LED-ER2:U$6.P1
LED-ER2:B2
  Top 0.305: LED-ER2:TLC1.15 64.66,44.28 64.66,43.96 | 67.84,9.87 67.85,7.76 arc-45 67.77,7.55 LED-ER2:U$6.P13
  Top 0.406: 64.66,43.96 64.66,16.67 64.66,14.02 67.84,10.83 67.84,9.87
LED-ER2:B3
  Top 0.305: LED-ER2:TLC1.18 67.53,42.33 67.53,42.01 | 72.94,9.87 72.94,7.75 arc-45 72.87,7.57 LED-ER2:U$6.P9
  Top 0.406: 67.53,42.01 67.53,21.13 67.53,18.47 72.94,13.06 72.94,9.87
LED-ER2:G0
  Top 0.305: LED-ER2:TLC1.4 81.86,42.98 81.86,42.68
  Top 0.406: 81.86,42.68 81.86,16.99 arc-45 81.78,16.81 76.76,11.79 76.76,8.94 arc-45 LED-ER2:U$6.P6
LED-ER2:G1
  Top 0.305: LED-ER2:TLC1.7 84.72,44.93 84.72,44.27
  Top 0.406: 84.72,44.61 84.72,44.27 84.72,10.62 arc-45 84.65,10.44 83.13,8.92 LED-ER2:U$6.P2 arc45 LED-ER2:U$6.P2
LED-ER2:G2
  Top 0.305: LED-ER2:TLC1.14 63.7,44.93 63.7,44.27
  Top 0.406: 63.7,44.61 63.7,44.27 63.7,15.71 63.7,11.8 LED-ER2:U$6.P14
LED-ER2:G3
  Top 0.305: LED-ER2:TLC1.17 66.57,42.98 66.57,42.36
  Top 0.406: 66.57,42.66 66.57,42.36 66.57,20.49 66.57,16.88 71.67,11.79 LED-ER2:U$6.P10
LED-ER2:IREF
  Top 0.254: 73.58,40.13 LED-ER2:R3.1 | 78.36,28.03 LED-ER2:R6.1
  Top 0.305: LED-ER2:TLC1.1 77.65,40.88
  Top 0.406: 73.58,40.13 77.65,40.13 77.65,40.88 | LED-ER2:R3.1 73.58,28.03 78.36,28.03
LED-ER2:R0
  Top 0.305: LED-ER2:TLC1.3 80.9,42.33 80.9,41.73
  Top 0.406: 80.9,42.01 80.9,41.73 80.9,17.94 arc-45 80.83,17.76 74.21,11.15 74.21,8.92 arc-45 LED-ER2:U$6.P8
LED-ER2:R1
  Top 0.305: LED-ER2:TLC1.6 83.77,44.28 83.77,43.96
  Top 0.406: 83.77,43.96 83.77,14.76 arc-45 83.69,14.58 79.31,10.19 79.31,8.96 arc-45 LED-ER2:U$6.P4
LED-ER2:R2
  Top 0.305: LED-ER2:TLC1.13 62.75,45.58 62.75,43.35
  Top 0.406: 62.75,43.35 62.75,14.76 62.75,10.22 LED-ER2:U$6.P16
LED-ER2:R3
  Top 0.305: LED-ER2:TLC1.16 65.61,43.63 65.61,43.31
  Top 0.406: 65.61,43.31 65.61,17.94 65.61,15.61 69.12,12.1 69.12,8.93 LED-ER2:U$6.P12
LED-ER3:B0
  Top 0.305: LED-ER3:TLC1.5 57.01,43.63 57.01,43.31 | 53.51,21.66 53.51,19.55 arc-45 53.44,19.37 LED-ER3:U$6.P5
  Top 0.406: 57.01,43.31 57.01,25.27 arc-45 56.94,25.09 53.51,21.66
LED-ER3:B1
  Top 0.305: LED-ER3:TLC1.8 59.88,45.58 59.88,43.35
  Top 0.406: 59.88,43.35 59.88,19.54 arc-45 59.81,19.36 58.61,18.16 57.31,18.16 arc-45 LED-ER3:U$6.P1
LED-ER3:B2
  Top 0.305: LED-ER3:TLC1.15 39.5,44.28 39.5,43.96 | 43.32,21.34 43.32,19.52 arc-45 43.24,19.34 LED-ER3:U$6.P13
  Top 0.406: 39.5,43.96 39.5,27.5 arc45 39.57,27.32 43.32,23.57 43.32,21.34
LED-ER3:B3
  Top 0.305: LED-ER3:TLC1.18 42.36,42.33 42.36,42.01 | 48.41,21.34 48.41,19.54 arc-45 48.34,19.36 LED-ER3:U$6.P9
  Top 0.406: 42.36,42.01 42.36,30.05 arc45 42.44,29.87 48.41,23.89 48.41,21.34
LED-ER3:G0
  Top 0.305: LED-ER3:TLC1.4 56.06,42.98 56.06,42.66
  Top 0.406: 56.06,42.66 56.06,26.22 arc-45 55.98,26.04 52.24,22.3 52.24,20.73 arc-45 LED-ER3:U$6.P6
LED-ER3:G1
  Top 0.305: LED-ER3:TLC1.7 58.92,44.93 58.92,44.61
  Top 0.406: 58.92,44.61 58.92,21.13 arc-45 58.85,20.95 58.61,20.7 57.31,20.7 arc45 LED-ER3:U$6.P2
LED-ER3:G2
  Top 0.305: LED-ER3:TLC1.14 38.54,44.93 38.54,44.61
  Top 0.406: 38.54,44.61 38.54,26.54 arc45 38.62,26.36 42.04,22.93 42.04,20.75 arc45 LED-ER3:U$6.P14
LED-ER3:G3
  Top 0.305: LED-ER3:TLC1.17 41.41,42.98 41.41,42.66
  Top 0.406: 41.41,42.66 41.41,29.41 arc45 41.48,29.23 47.14,23.57 LED-ER3:U$6.P10 arc45 LED-ER3:U$6.P10
LED-ER3:IREF  (1 unrouted)
  Top 0.254: 47.15,40.13 LED-ER3:R3.1
  Top 0.305: 51.92,41.03 51.92,40.84
  Top 0.406: 47.15,40.13 51.92,40.13 51.92,40.84 | LED-ER3:R6.1 47.15,28.87 LED-ER3:R3.1
LED-ER3:R0
  Top 0.305: LED-ER3:TLC1.3 55.1,42.33 55.1,42.01
  Top 0.406: 55.1,42.01 55.1,27.5 arc-45 55.03,27.32 49.69,21.98 LED-ER3:U$6.P8 arc-45 LED-ER3:U$6.P8
LED-ER3:R1
  Top 0.305: LED-ER3:TLC1.6 57.97,44.28 57.97,43.96
  Top 0.406: 57.97,43.96 57.97,24.01 arc-45 57.9,23.83 LED-ER3:U$6.P4
LED-ER3:R2
  Top 0.305: LED-ER3:TLC1.13 37.59,45.58 37.59,43.35
  Top 0.406: 37.59,43.35 37.59,20.95 arc90 37.84,20.7 LED-ER3:U$6.P16
LED-ER3:R3
  Top 0.305: LED-ER3:TLC1.16 40.45,43.63 40.45,43.32
  Top 0.406: 40.45,43.32 40.45,28.45 arc45 40.53,28.27 44.59,24.21 44.59,20.73 arc45 LED-ER3:U$6.P12
LED-ER4:B0
  Top 0.305: LED-ER4:TLC1.5 32.17,43.63 32.17,43.31 | 28.67,9.55 28.67,7.66 LED-ER4:U$6.P5
  Top 0.406: 32.17,43.31 32.17,14.33 28.67,10.83 28.67,9.55
LED-ER4:B1
  Top 0.305: LED-ER4:TLC1.8 35.04,45.58 35.04,43.35
  Top 0.406: 35.04,43.35 35.04,7.33 34.08,6.37 LED-ER4:U$6.P1
LED-ER4:B2
  Top 0.305: LED-ER4:TLC1.15 14.02,44.28 14.02,43.96 | 18.47,9.87 18.47,7.63 LED-ER4:U$6.P13
  Top 0.406: 14.02,43.96 14.02,14.33 18.47,9.87
LED-ER4:B3
  Top 0.305: LED-ER4:TLC1.18 16.88,42.33 16.88,42.01 | 23.57,9.55 23.57,7.64 LED-ER4:U$6.P9
  Top 0.406: 16.88,42.01 16.88,20.17 16.88,17.52 23.57,10.83 23.57,9.55
LED-ER4:G0
  Top 0.305: LED-ER4:TLC1.4 31.21,42.98 31.21,42.66
  Top 0.406: 31.21,42.66 31.21,15.61 27.39,11.79 27.39,8.93 LED-ER4:U$6.P6
LED-ER4:G1
  Top 0.305: LED-ER4:TLC1.7 34.08,44.93 34.08,44.61
  Top 0.406: 34.08,44.61 34.08,12.1 32.49,10.51 32.49,8.94 LED-ER4:U$6.P2
LED-ER4:G2
  Top 0.305: LED-ER4:TLC1.14 13.06,44.93 13.06,44.61
  Top 0.406: 13.06,44.61 13.06,13.07 LED-ER4:U$6.P14
LED-ER4:G3
  Top 0.305: LED-ER4:TLC1.17 15.93,42.98 15.93,42.66
  Top 0.406: 15.93,42.66 15.93,16.56 22.3,10.19 LED-ER4:U$6.P10
LED-ER4:IREF
  Top 0.254: LED-ER4:TLC1.1 27.07,41.03 | 22.3,40.13 LED-ER4:R3.1
  Top 0.305: 27.07,41.03 27.07,40.83
  Top 0.406: 22.3,40.13 27.07,40.13 27.07,40.83 | LED-ER4:R6.1 22.3,27.92 LED-ER4:R3.1
LED-ER4:R0
  Top 0.305: LED-ER4:TLC1.3 30.26,42.33 30.26,42.01
  Top 0.406: 30.26,42.01 30.26,16.88 24.84,11.47 LED-ER4:U$6.P8
LED-ER4:R1
  Top 0.305: LED-ER4:TLC1.6 33.13,44.28 33.13,43.96
  Top 0.406: 33.13,43.96 33.13,13.38 29.94,10.19 29.94,8.94 LED-ER4:U$6.P4
LED-ER4:R2
  Top 0.305: LED-ER4:TLC1.13 12.1,45.58 12.1,44.91
  Top 0.406: 12.1,44.94 12.1,44.91 12.1,9.87 13.06,8.92 LED-ER4:U$6.P16
LED-ER4:R3
  Top 0.305: LED-ER4:TLC1.16 14.97,43.63 14.97,43.31
  Top 0.406: 14.97,43.31 14.97,17.62 14.97,15.29 19.75,10.51 19.75,8.93 LED-ER4:U$6.P12
N$1
  Top 0.305: R2.2
  Top 0.61: LED1.K R2.2
N$2
  Top 0.305: LED-ER2:TLC1.10 84.41,46.88 | 84.41,46.88 LED-ER1:TLC1.11 | LED-ER1:TLC1.11 | JP1.2 84.41,48.15 84.41,46.88
N$3
  Top 0.305: LED-ER2:TLC1.9 86.95,46.23 | 86.95,46.23 LED-ER1:TLC1.12 | LED-ER1:TLC1.12 | JP1.1 86.95,44.85 86.95,46.23
N$4
  Top 0.305: LED-ER2:TLC1.11 58.81,46.88 | 58.81,46.88 LED-ER3:TLC1.10 | JP2.2 58.81,48.21 58.81,46.88
N$5
  Top 0.305: LED-ER3:TLC1.9 61.37,46.23 | 61.37,46.23 LED-ER2:TLC1.12 | JP2.1 61.37,44.91 61.37,46.23
N$6
  Top 0.305: LED-ER3:TLC1.11 33.76,46.88 | 33.76,46.88 LED-ER4:TLC1.10 | JP3.2 33.76,48.23 33.76,46.88
N$7
  Top 0.305: LED-ER4:TLC1.9 36.31,46.23 | 36.31,46.23 LED-ER3:TLC1.12 | JP3.1 36.31,44.93 36.31,46.23
N$8
  Top 0.305: JP_SIGOUT.1 14.52,46.88 LED-ER4:TLC1.11
N$9
  Top 0.305: LED-ER4:TLC1.12 11.98,46.23 JP_SIGOUT.2
N$54
  Top 0.406: U$5.GND2 115.41,31.95 112.44,28.98 112.44,20.39 114.35,18.47 119.12,18.47 140.47,39.81 140.47,46.19 JP_PROG.1
N$55
  Top 0.406: U$5.PROG 115.09,29.41 113.39,27.71 113.39,21.34 114.98,19.75 118.49,19.75 137.92,39.18 137.92,46.18 JP_PROG.2
VIN
  Top 0.813: JP_15VIN.2 131.87,7.02 129,4.14 | 122.95,4.14 +V_LED.1 | +V_LED.1
  Top 2.54: 129,4.14 122.95,4.14
  pour Top (isolate 0.406): 87.91,19.11 108.93,19.11 108.93,7.64 124.22,7.64 124.22,0.32 11.15,0.32 11.15,7.01 37.9,7.01 37.9,18.47 59.88,18.47 59.88,6.69 87.91,6.69
  pour Top (isolate 0.406): 126.13,0.32 151.3,0.32 151.3,16.88 150.34,17.84 136.32,17.84 126.13,7.96

### Text on the board
tPlace: CLK | CLK | CLK | CIN | DIN | DO | CO | PROG | SIG | SIG | SIG | +5V | r | g | r | g | r | g | r | g | 3 | 1 | V+ | b | V+ | b | V+ | b | V+ | b | 3 | 4 | 1 | 2 | +5V | 4 | 2 | GND | V+